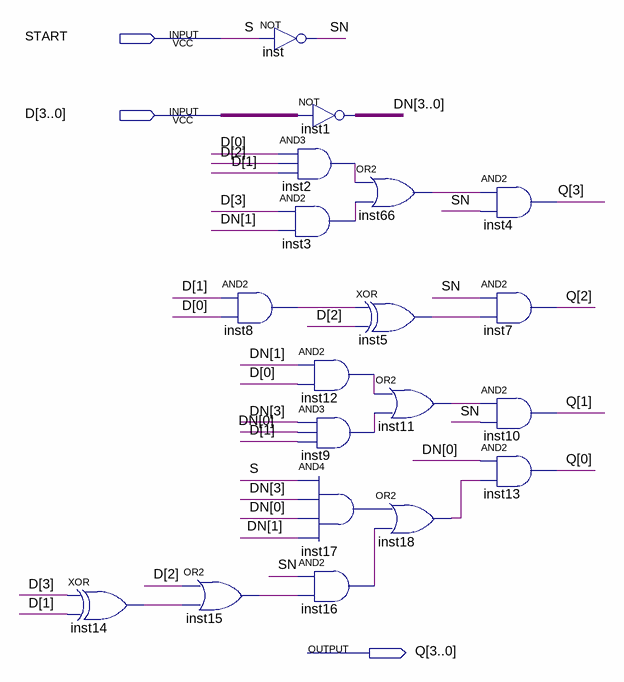
[diagram p0: schematic sheet]
// Quartus schematic NEXTSTATE.bdf as structural Verilog: 19 symbols, 3 pins
module NEXTSTATE (
  input  START,
  input  [3:0] D,
  output [3:0] Q
);

  wire inst2_out, inst3_out, inst5_out, inst8_out, inst9_out, inst11_out, inst12_out, inst14_out, inst15_out,
       inst16_out, inst17_out, inst18_out, inst66_out, SN;
  wire [3:0] DN;

  xor inst14 (inst14_out, D[3], D[1]);
  and inst8 (inst8_out, D[1], D[0]);
  or inst15 (inst15_out, D[2], inst14_out);
  not inst (SN, START);
  assign DN = ~D;  // NOT inst1, 4 bits wide
  and inst2 (inst2_out, D[0], D[2], D[1]);
  and inst3 (inst3_out, D[3], DN[1]);
  and inst12 (inst12_out, DN[1], D[0]);
  and inst9 (inst9_out, DN[3], DN[0], D[1]);
  and inst17 (inst17_out, START, DN[3], DN[0], DN[1]);
  and inst16 (inst16_out, SN, inst15_out);
  or inst66 (inst66_out, inst2_out, inst3_out);
  xor inst5 (inst5_out, inst8_out, D[2]);
  or inst11 (inst11_out, inst12_out, inst9_out);
  or inst18 (inst18_out, inst17_out, inst16_out);
  and inst4 (Q[3], inst66_out, SN);
  and inst7 (Q[2], SN, inst5_out);
  and inst10 (Q[1], inst11_out, SN);
  and inst13 (Q[0], DN[0], inst18_out);

  // Other names for the same wires on the sheet: S = START
endmodule
